# Altium schematic sheet Memory_Add_Register.SchDoc
size Letter; SheetNumber: 5; SheetTotal: 9
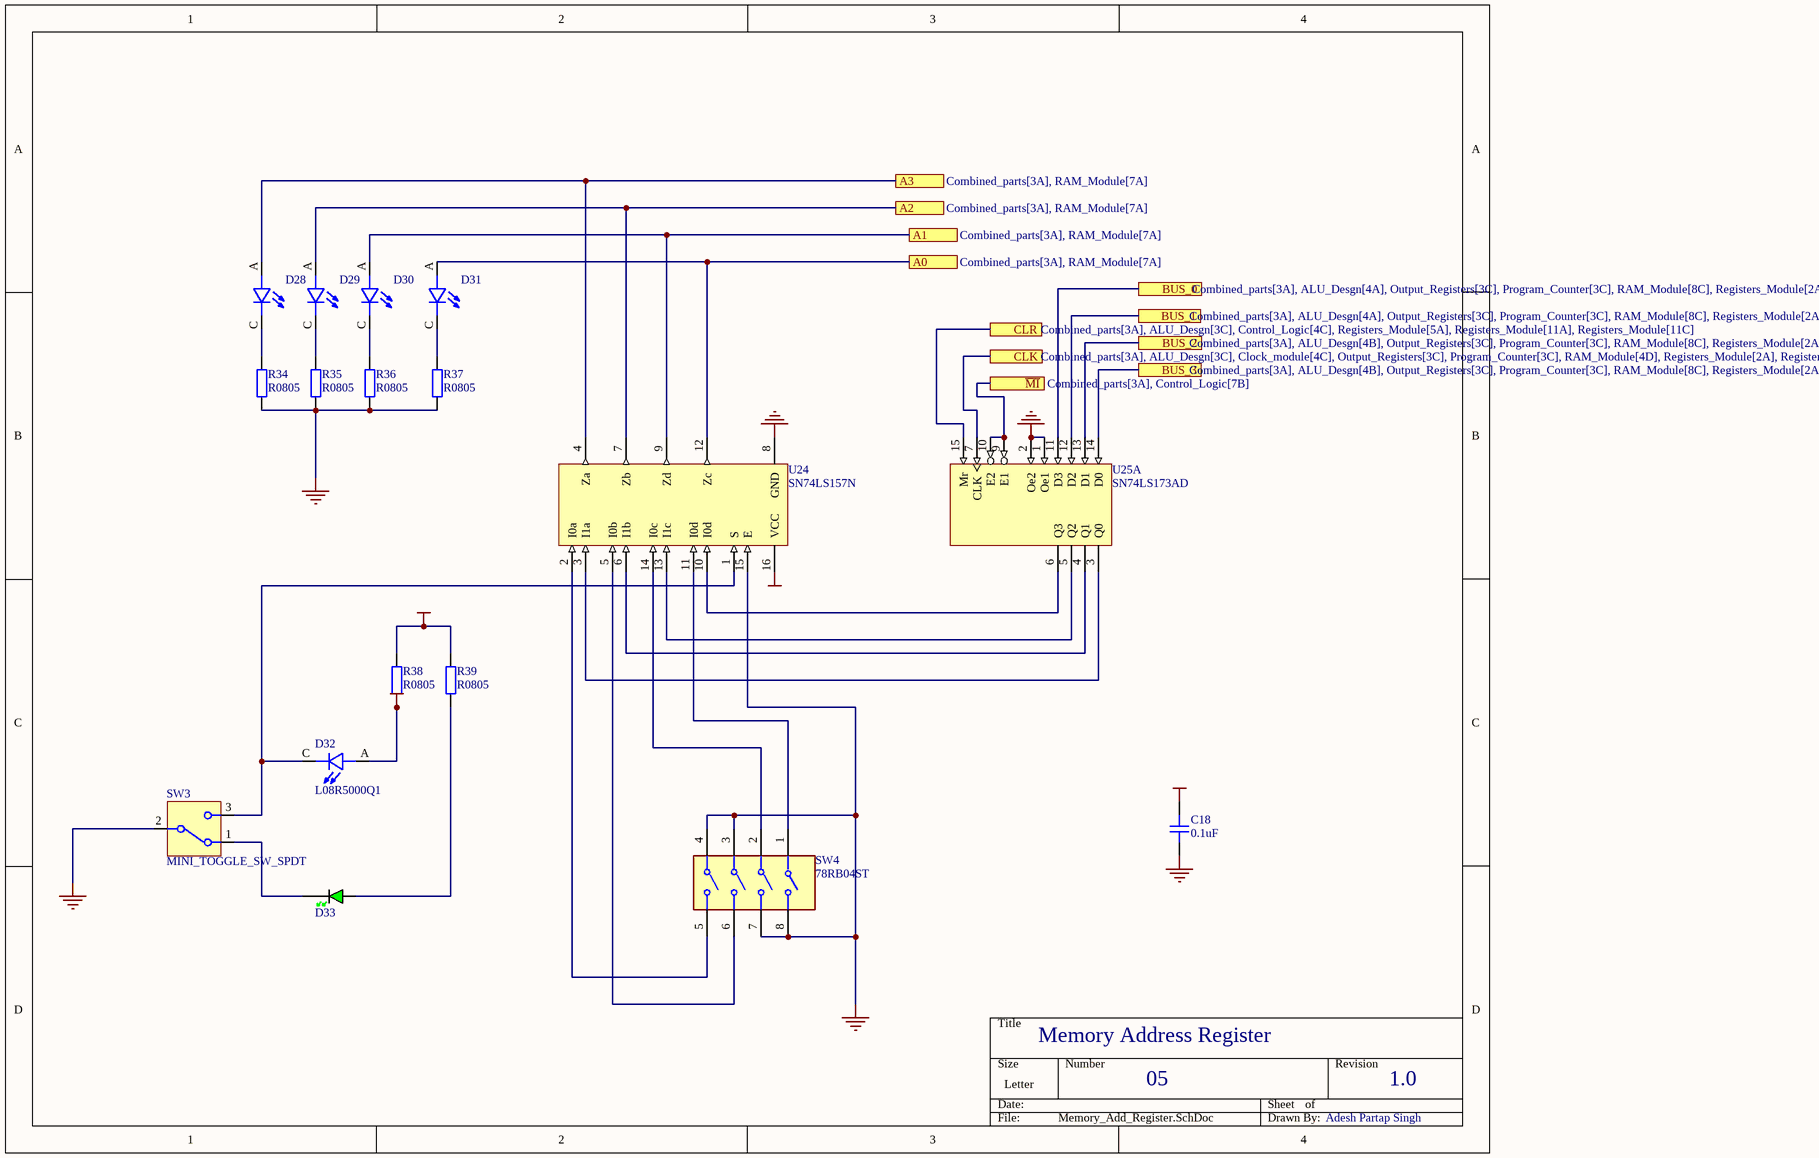
[diagram p0: Memory_Add_Register.SchDoc]

## Parts
C18  0.1uF  [CAP_0805]
D28  L08R5000Q1  [LEDRD254W57D500H1070]  (value not drawn)
D29  L08R5000Q1  [LEDRD254W57D500H1070]  (value not drawn)
D30  L08R5000Q1  [LEDRD254W57D500H1070]  (value not drawn)
D31  L08R5000Q1  [LEDRD254W57D500H1070]  (value not drawn)
D32  L08R5000Q1  [LEDRD254W57D500H1070]
D33  GREEN  [LED_0805_GREEN]  (value not drawn)
R34  R0805  [RES_0805]
R35  R0805  [RES_0805]
R36  R0805  [RES_0805]
R37  R0805  [RES_0805]
R38  R0805  [RES_0805]
R39  R0805  [RES_0805]
SW3  MINI_TOGGLE_SW_SPDT  [MINI_TOGGLE_SW_SPDT]
SW4  78RB04ST  [FP-78RB04ST-MFG]
U24  SN74LS157N  [N0016A]
U25  SN74LS173AD  [D0016A_N]  (part A of 2)

## Ports
A0 (see Combined_parts[3A], RAM_Module[7A]), A1 (see Combined_parts[3A], RAM_Module[7A]), A2 (see Combined_parts[3A], RAM_Module[7A]), A3 (see Combined_parts[3A], RAM_Module[7A]), BUS_0 (see Combined_parts[3A], ALU_Desgn[4A], Output_Registers[3C], Program_Counter[3C], RAM_Module[8C], Registers_Module[2A], Registers_Module[8A], Registers_Module[8C]), BUS_1 (see Combined_parts[3A], ALU_Desgn[4A], Output_Registers[3C], Program_Counter[3C], RAM_Module[8C], Registers_Module[2A], Registers_Module[8A], Registers_Module[8C]), BUS_2 (see Combined_parts[3A], ALU_Desgn[4B], Output_Registers[3C], Program_Counter[3C], RAM_Module[8C], Registers_Module[2A], Registers_Module[8A], Registers_Module[8C]), BUS_3 (see Combined_parts[3A], ALU_Desgn[4B], Output_Registers[3C], Program_Counter[3C], RAM_Module[8C], Registers_Module[2A], Registers_Module[8A], Registers_Module[8C]), CLK (see Combined_parts[3A], ALU_Desgn[3C], Clock_module[4C], Output_Registers[3C], Program_Counter[3C], RAM_Module[4D], Registers_Module[2A], Registers_Module[8A], Registers_Module[8C]), CLR (see Combined_parts[3A], ALU_Desgn[3C], Control_Logic[4C], Registers_Module[5A], Registers_Module[11A], Registers_Module[11C]), ~{MI} (see Combined_parts[3A], Control_Logic[7B])

## Nets
GND: C18.1 R34.1 R35.1 R36.1 R37.1 SW3.2(COM) SW4.3 SW4.4 SW4.7 SW4.8 U24.8(GND) U24.15(E) U25.1(Oe1) U25.2(Oe2)
VCC: C18.2 D32.A R38.1 R38.2 R39.2 U24.16(VCC)
A0: D31.A U24.12(Zc) ; port A0
A1: D30.A U24.9(Zd) ; port A1
A2: D29.A U24.7(Zb) ; port A2
A3: D28.A U24.4(Za) ; port A3
BUS_0: U25.11(D3) ; port BUS_0
BUS_1: U25.12(D2) ; port BUS_1
BUS_2: U25.13(D1) ; port BUS_2
BUS_3: U25.14(D0) ; port BUS_3
CLK: U25.7(CLK) ; port CLK
CLR: U25.15(Mr) ; port CLR
~{MI}: U25.9(E1) U25.10(E2) ; port ~{MI}
NetD28_C: D28.C R34.2
NetD29_C: D29.C R35.2
NetD30_C: D30.C R36.2
NetD31_C: D31.C R37.2
NetD32_C: D32.C SW3.3 U24.1(S)
NetD33_A: D33.A R39.1
NetD33_K: D33.K SW3.1
NetSW4_1: SW4.1 U24.11(I0d)
NetSW4_2: SW4.2 U24.14(I0c)
NetSW4_5: SW4.5 U24.2(I0a)
NetSW4_6: SW4.6 U24.5(I0b)
NetU24_3: U24.3(I1a) U25.3(Q0)
NetU24_6: U24.6(I1b) U25.4(Q1)
NetU24_10: U24.10(I0d) U25.6(Q3)
NetU24_13: U24.13(I1c) U25.5(Q2)

## Notes on the sheet
- Memory Address Register
- 05
- 1.0
- Adesh Partap Singh

## Library data of the parts
C18 = CAP_0805: Capacitor SMD 0805; Manufacturer: *; Manufacturer Part Number: *; Distributor Link: *; LCSC: *; Rating: *; Dielectric: *
D28-D32 = L08R5000Q1: LED, 5MM, ORANGE; LED / Lamp Size: 5mm / T-1 3/4; LED Colour: Orange; Typ Luminous Intensity: 4.3mcd; Viewing Angle: ...; MF: LED Technology; Value: *; SnapEDA_Link: https://www.snapeda.com/parts/L08R5000Q1/LED+Technology/view-part/?ref=snap; MP: L08R5000Q1; Check_prices: https://www.snapeda.com/parts/L08R5000Q1/LED+Technology/view-part/?ref=eda; Availability: In Stock; Price: None; Package: None
D33 = LED_0805_GREEN: LED 0805 GREEN SMD; Manufacturer: *; Manufacturer Part Number: *; Distributor Link: *; LCSC: *
R34-R39 = RES_0805: Resistor SMD 0805; Manufacturer: *; Manufacturer Part Number: *; Distributor Link: *; LCSC: *
SW3 = MINI_TOGGLE_SW_SPDT: Mini Toggle Switch SPDT THT
SW4 = CMP-31942-000006-1: SWITCH SLIDE DIP SPST 150MA 30V; Electrical Life: 2000Cycles; Number of Positions: 4; Actuator Type: Slide (Standard); Body Material: Thermoplastic; Washable: Yes; Pitch: 0.1inch; Contact Plating: Gold; Mount: Through Hole; Max Voltage Rating (DC): 30V; Length: 0.48inch; Orientation: Straight; Max Operating Temperature: 85°C; Min Operating Temperature: -40°C; Lead Free: Lead Free; RoHS Compliant: Yes; Series: 78; Termination: PC Pins; Mechanical Life: 2000Cycles; Max Current Rating: 150mA; Current Rating: 150mA; Throw Configuration: SPST; Packaging: Rail/Tube; Voltage Rating (DC): 30V; Contact Material: Copper Alloy
U24 = CMP-1633-00683-2: Quadruple 2-Line To 1-Line Data Selectors/Multiplexers, N0016A, TUBE; Manufacturer: Texas Instruments; Configuration: 2：1; Voltage(Nom)(V): 5; ICC @ Nom Voltage(Max)(mA): 16; VCC(Min)(V): 4.75; Channels(#): 4; Rating: Military; tpd @ Nom Voltage(Max)(ns): 14; F @ Nom Voltage(Max)(Mhz): 35; Technology Family: LS; Output Drive (IOL/IOH)(Max)(mA): 8/-0.4; Function: Encoder/Multiplexer; Schmitt Trigger: No; VCC(Max)(V): 5.25; Generic Part Number: SN74LS157; DatasheetVersion: SDLS058; Code_JEDEC: MS-001; Operating Temperature Range(C): 0 to 70; Type: Standard; PackageReference: N0016A
U25 = CMP-1616-00008-3: 4-Bit D-type Registers with 3-State Outputs, D0016A, TUBE; Manufacturer: Texas Instruments; Output Logic: Non-inverted; F @ Nom Voltage(Max)(Mhz): 35; VCC(Max)(V): 5.25; VCC(Min)(V): 4.75; tpd @ Nom Voltage(Max)(ns): 30; 3-State Output: Yes; ICC @ Nom Voltage(Max)(mA): 24; Voltage(Nom)(V): 5; Output Type: TTL; Rating: Catalog; Bits(#): 4; Output: 3S; Technology Family: LS; Schmitt Trigger: No; Output Drive (IOL/IOH)(Max)(mA): 24/-2.6; PackageReference: D0016A; Generic Part Number: SN74LS173A; Input Type: TTL; Operating Temperature Range(C): 0 to 70; DatasheetVersion: SDLS067A; Code_JEDEC: MS-012 variation AC